# Altium project _USB Isolator v2.PrjPCB
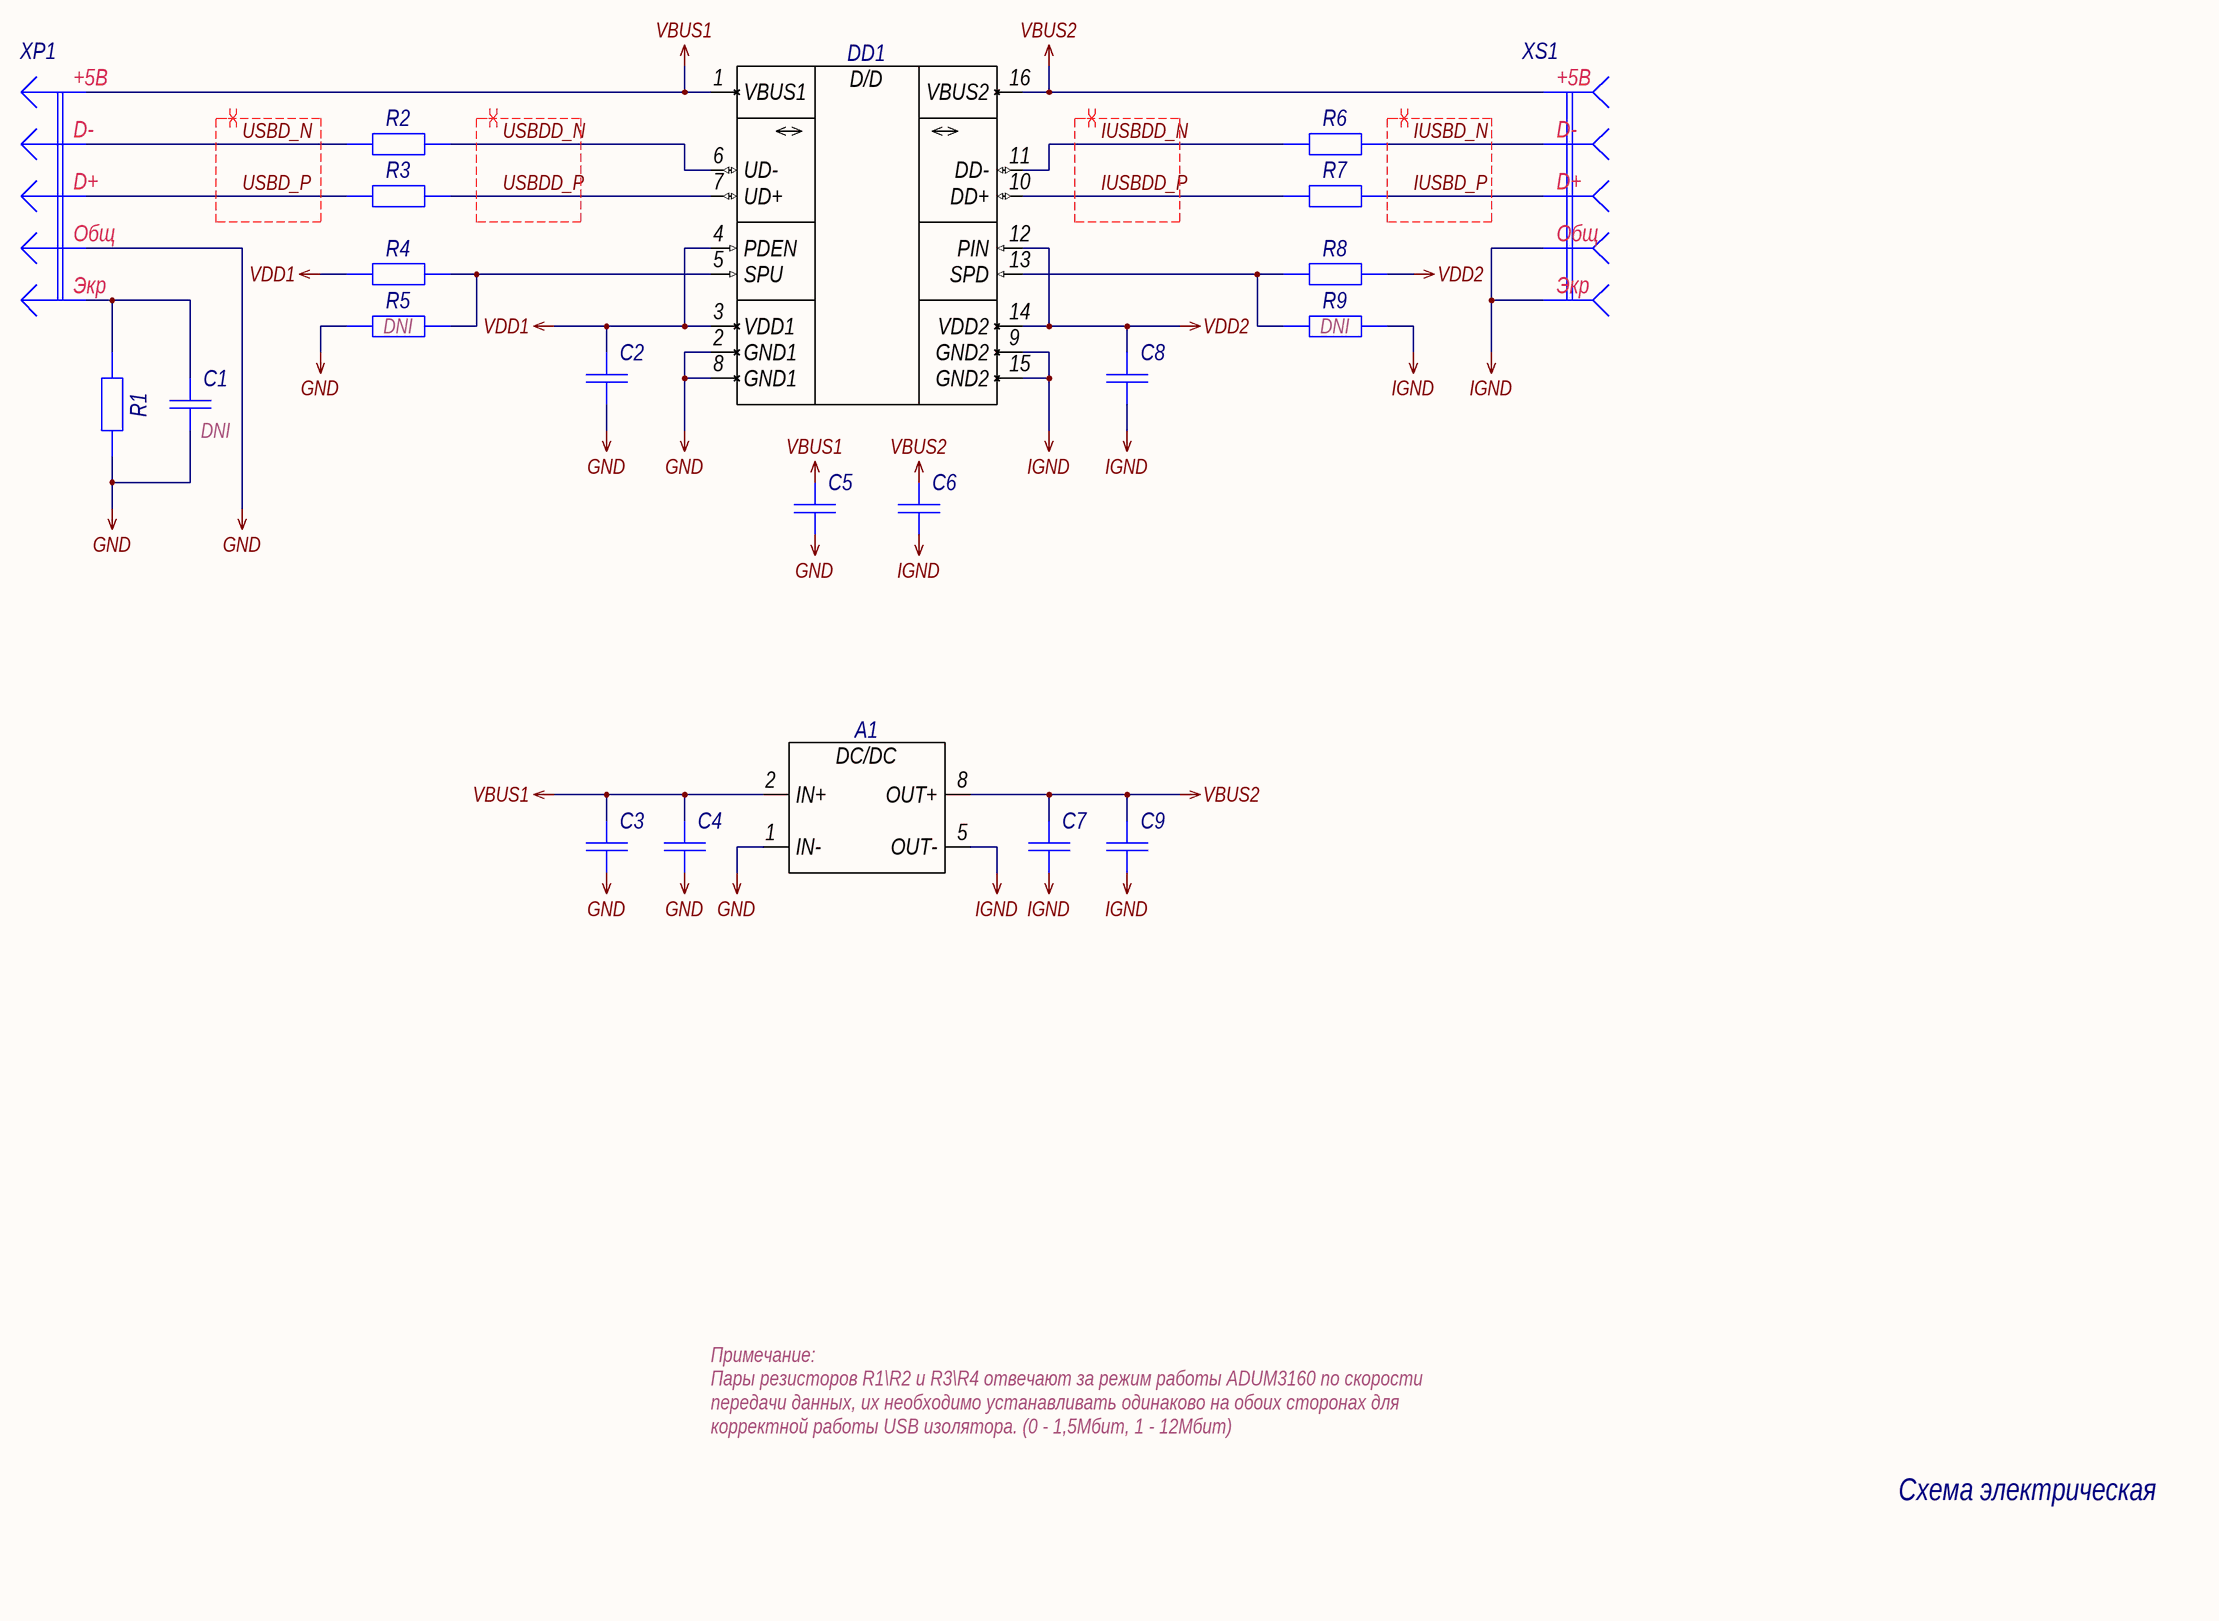
[diagram p0: 01_MAIN.SchDoc]
GlobalOrganizationName: A_D Electronics; GlobalProjectName: USB Isolator v2; GlobalProjectNumber: A_D.000000.001; GlobalProjectRevision: 1; PCB_Week: 1930
1 sheet, 22 parts. Net scope: global (net labels, ports and power ports of the same name join across sheets).
Board file: BOARD.PcbDoc

## Sheet 01_MAIN.SchDoc: =GlobalProjectName
size 594 x 420 mm; CheckedBy: A_D; Author: A_D; Organization: A_D Electronics; DocumentNumber: A_D.000000.001 Э3; Revision: 1; SheetNumber: 1; SheetTotal: 3; PageSetup: Record=PageOptions|CenterHorizontal=True|CenterVertical=True|PrintScale=0.70|XCorrection=1.00|YCorrection=1.00|PrintKind=2|BorderSize=5000000|LeftOffset=9000|BottomOffset=10100|Orientation=2|PaperLength=11176|PaperWidth=8636|Scale=100|PaperSource=259|PrintQuality=-3|MediaType=1|DitherType=10|PrintScaleMode=1|PaperKind=A3|PaperIndex=8; FirstApplication: A_D.000000.001; DocumentName: USB Isolator v2

### Parts
A1  AM1L-xxxxSH30-Series  [AM1L-xxxxSH30-Series]  (value not drawn)
C1  Capacitor  [C0603_L]  (value not drawn)  (no BOM)
C2  Capacitor  [C0603_L]  (value not drawn)
C3  Capacitor  [C0603_L]  (value not drawn)
C4  Capacitor  [C0603_L]  (value not drawn)
C5  Capacitor  [C0603_L]  (value not drawn)
C6  Capacitor  [C0603_L]  (value not drawn)
C7  Capacitor  [C0603_L]  (value not drawn)
C8  Capacitor  [C0603_L]  (value not drawn)
C9  Capacitor  [C0603_L]  (value not drawn)
DD1  ADuMx160-Series  [SOIC-16_127P1030X750X265_N]  (value not drawn)
R1  Resistor  [R0603_L]  (value not drawn)
R2  Resistor  [R0603_L]  (value not drawn)
R3  Resistor  [R0603_L]  (value not drawn)
R4  Resistor  [R0603_L]  (value not drawn)
R5  Resistor  [R0603_L]  (value not drawn)  (no BOM)
R6  Resistor  [R0603_L]  (value not drawn)
R7  Resistor  [R0603_L]  (value not drawn)
R8  Resistor  [R0603_L]  (value not drawn)
R9  Resistor  [R0603_L]  (value not drawn)  (no BOM)
XP1  HOST  [DS1097]  (value not drawn)
XS1  DEVICE  [2041335-1]  (value not drawn)

### Nets
GND: A1.1(IN-) C1.1 C2.1 C3.1 C4.1 C5.1 DD1.2(GND1) DD1.8(GND1) R1.1 R5.2 XP1.4
IGND: A1.5(OUT-) C6.1 C7.1 C8.1 C9.1 DD1.9(GND2) DD1.15(GND2) R9.1 XS1.4 XS1.5
VBUS1: A1.2(IN+) C3.2 C4.2 C5.2 DD1.1(VBUS1) XP1.1
VBUS2: A1.8(OUT+) C6.2 C7.2 C9.2 DD1.16(VBUS2) XS1.1
VDD1: C2.2 DD1.3(VDD1) DD1.4(PDEN) R4.2
VDD2: C8.2 DD1.12(PIN) DD1.14(VDD2) R8.1
IUSBD_N: R6.2 XS1.2
IUSBD_P: R7.2 XS1.3
IUSBDD_N: DD1.11(DD-) R6.1
IUSBDD_P: DD1.10(DD+) R7.1
USBD_N: R2.1 XP1.2
USBD_P: R3.1 XP1.3
USBDD_N: DD1.6(UD-) R2.2
USBDD_P: DD1.7(UD+) R3.2
NetC1_2: C1.2 R1.2 XP1.5
NetDD1_5: DD1.5(SPU) R4.1 R5.1
NetDD1_13: DD1.13(SPD) R8.2 R9.2

### Layout directives
differential pair: IUSBD_N, IUSBD_P, IUSBDD_N, IUSBDD_P, USBD_N, USBD_P, USBDD_N, USBDD_P

### Notes on the sheet
- (near R5) DNI
- (near R9) DNI
- (near C1) DNI
- Схема электрическая
  принципиальная
- Примечание:
  Пары резисторов R1\R2 и R3\R4 отвечают за режим работы ADUM3160 по скорости передачи данных, их необходимо устанавливать одинаково на обоих сторонах для корректной работы USB изолятора. (0 - 1,5Мбит, 1 - 12Мбит)
- Перв. примен.
- Справ. №
- Подп. и дата
- Инв. № дубл.
- Взам. инв. №
- Разраб.
- Изм.
- Лист
- № докум.
- Подп.
- Дата
- Литера
- Масса
- Масштаб
- Пров.
- Т.контр.
- Листов
- Инв. № подл.
- Н.контр.
- Утв.
- Форма 1 ГОСТ 2.104-2006
- Копировал
- Формат А2
- (in symbol 2041335-1) +5В; D-; D+; Общ; Экр
- (in symbol ADUM3160BRWZ) D/D
- (in symbol AM1L-0505SH30-NZ) DC/DC
- (in symbol DS1097-B) +5В; D-; D+; Общ; Экр

### Library data of the parts
A1 = AM1L-0505SH30-NZ: Manufacturer: Aimtec; ID: 2; Supply Operation: +4.5…5.5V; Output Current Min: ±20mA; Output Current Max: ±200mA; Output Voltage: +5V; Efficiency: 70%; I-O Isolation: 3kV; Application Category: 1; Working Temperature Min: -40°С; Working Temperature Max: +85°С; Published: 29.07.2015; Publisher: Andrew Danich; Type: Модуль; Part Number: AM1L-0505SH30-NZ; Value: AM1L-0505SH30-NZ; Functional Analog: -
C1-C3 C5 C6 C8 C9 = GRM188R72A104KA35D: Manufacturer: Murata; Type: Конденсатор; ID: 232; Value: 0.1uF; Voltage: 100V; Tolerance: ±10%; Dielectric Type: X7R; Application Category: 1; Working Temperature Min: -55°С; Working Temperature Max: +125°С; Published: 18.05.2010; Publisher: Andrew Danich; Part Number: GRM188R72A104KA35D; Footprint: 0603
  C1: ClassName: DirectConnect
C4 = GRM188R61A106KE69D: Manufacturer: Murata; Type: Конденсатор; ID: 173; Value: 10uF; Voltage: 10V; Tolerance: ±10%; Dielectric Type: X5R; Application Category: 1; Working Temperature Min: -55°С; Working Temperature Max: +85°С; Published: 18.05.2010; Publisher: Andrew Danich; Part Number: GRM188R61A106KE69D; Footprint: 0603
C7 = GRM188R61A226ME15D: Manufacturer: Murata; Type: Конденсатор; ID: 256; Value: 22uF; Voltage: 10V; Tolerance: ±20%; Dielectric Type: X5R; Application Category: 1; Working Temperature Min: -55°С; Working Temperature Max: +85°С; Published: 18.05.2010; Publisher: Andrew Danich; Part Number: GRM188R61A226ME15D; Footprint: 0603
DD1 = ADUM3160BRWZ: Manufacturer: Analog Devices; ID: 1; Supply Operation: +4.5…5.5V; Supply Current: 8mA; Data Rate: 12Mbts; Forward Channels: 2; Peak-to-peak Jitter: 3ns; Interface: USB 2.0; Functional Analog: ADUM4160BRWZ; Published: 29.07.2015; Publisher: Andrew Danich; Type: Микросхема; Part Number: ADUM3160BRWZ; Value: ADUM3160BRWZ; Opposite Channels: 2; Application Category: 1
R1 R4 R5 R8 R9 = RC0603JR-070R: Manufacturer: Yageo; ID: 5; Value: 0; Limit Voltage: 50V; Tolerance: ±5%; Temperature Coefficient: 100ppm; Total Power Dissipation: 0.1W; Series Type: Thick-Film; Application Category: 1; Working Temperature Min: -55°С; Working Temperature Max: +155°С; Functional Analog: RC0603FR-070RL, CR0603-J/-000E; Published: 24.03.2010; Publisher: Andrew Danich; Type: Резистор; Part Number: RC0603JR-070R; Footprint: 0603
  R1: ClassName: DirectConnect
R2 R3 R6 R7 = RC0603JR-0722RL: Manufacturer: Yageo; ID: 29; Value: 22; Limit Voltage: 50V; Tolerance: ±5%; Temperature Coefficient: 100ppm; Total Power Dissipation: 0.1W; Series Type: Thick-Film; Application Category: 1; Working Temperature Min: -55°С; Working Temperature Max: +155°С; Published: 24.03.2010; Publisher: Andrew Danich; Type: Резистор; Part Number: RC0603JR-0722RL; Footprint: 0603
XP1 = DS1097-B: Manufacturer: Connfly Electronic Co., Ltd; ID: 3; Limit Voltage: 30V; Limit Current: 1.5A; Connector Type: Male; Interface: USB 2.0; Max Data Rate: 480 mbps; Application Category: 1; Functional Analog: USB-AR, DS1097-W; Published: 13.08.2015; Publisher: Andrew Danich; Type: Вилка; Part Number: DS1097-B; Value: DS1097-B; Pins: 6; Mount Type: Through hole
XS1 = 2041335-1: Manufacturer: TE Connectivity; ID: 39; Limit Voltage: 30V; Limit Current: 1.5A; Connector Type: Female; Interface: USB 2.0; Max Data Rate: 480 mbps; Application Category: 1; Functional Analog: Jing Extension of the Electronic Co. A/FLCPVinyl; Value: 2041335-1; Published: 07.03.2013; Publisher: Andrew Danich; Type: Розетка; Part Number: 2041335-1; Pins: 5; Mount Type: Surface